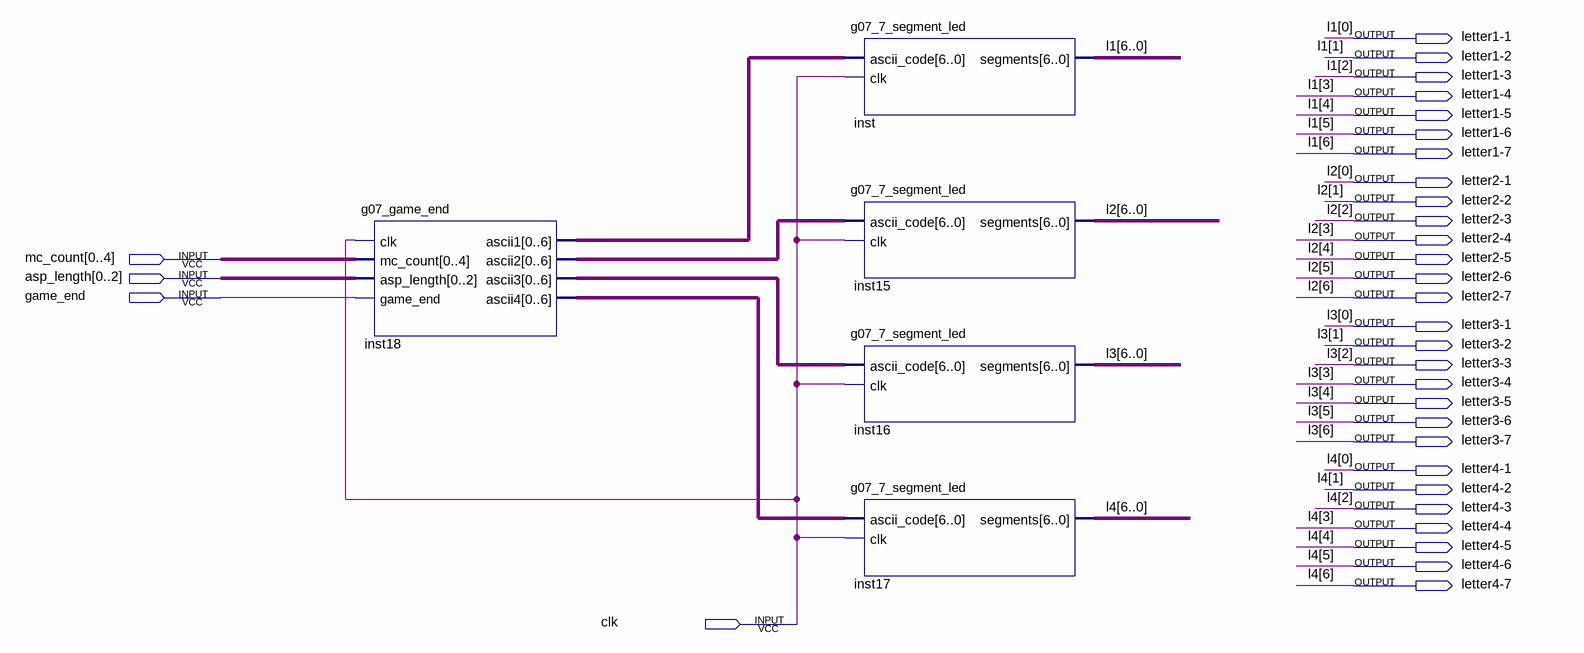
[diagram p0: schematic sheet]
// Quartus schematic g07_game_termination.bdf as structural Verilog: 5 symbols, 32 pins
module g07_game_termination (
  input  [0:4] mc_count,
  input  [0:2] asp_length,
  input  game_end,
  input  clk,
  output \letter1-1 ,
  output \letter1-2 ,
  output \letter1-3 ,
  output \letter1-4 ,
  output \letter1-5 ,
  output \letter1-6 ,
  output \letter1-7 ,
  output \letter2-1 ,
  output \letter2-2 ,
  output \letter2-3 ,
  output \letter2-4 ,
  output \letter2-5 ,
  output \letter2-6 ,
  output \letter2-7 ,
  output \letter3-1 ,
  output \letter3-2 ,
  output \letter3-3 ,
  output \letter3-4 ,
  output \letter3-5 ,
  output \letter3-6 ,
  output \letter3-7 ,
  output \letter4-1 ,
  output \letter4-2 ,
  output \letter4-3 ,
  output \letter4-4 ,
  output \letter4-5 ,
  output \letter4-6 ,
  output \letter4-7 
);

  wire [6:0] inst18_ascii1, inst18_ascii2, inst18_ascii3, inst18_ascii4;

  g07_game_end inst18 (
    .clk(clk), .mc_count(mc_count), .asp_length(asp_length), .game_end(game_end), .ascii1(inst18_ascii1),
    .ascii2(inst18_ascii2), .ascii3(inst18_ascii3), .ascii4(inst18_ascii4));
  g07_7_segment_led inst (
    .ascii_code(inst18_ascii1), .clk(clk),
    .segments({\letter1-7 , \letter1-6 , \letter1-5 , \letter1-4 , \letter1-3 , \letter1-2 , \letter1-1 }));
  g07_7_segment_led inst15 (
    .ascii_code(inst18_ascii2), .clk(clk),
    .segments({\letter2-7 , \letter2-6 , \letter2-5 , \letter2-4 , \letter2-3 , \letter2-2 , \letter2-1 }));
  g07_7_segment_led inst16 (
    .ascii_code(inst18_ascii3), .clk(clk),
    .segments({\letter3-7 , \letter3-6 , \letter3-5 , \letter3-4 , \letter3-3 , \letter3-2 , \letter3-1 }));
  g07_7_segment_led inst17 (
    .ascii_code(inst18_ascii4), .clk(clk),
    .segments({\letter4-7 , \letter4-6 , \letter4-5 , \letter4-4 , \letter4-3 , \letter4-2 , \letter4-1 }));

  // Other names for the same wires on the sheet: l1[6:0] = {\letter1-7 , \letter1-6 , \letter1-5 , \letter1-4 , \letter1-3 , \letter1-2 , \letter1-1 };
  //   l2[6:0] = {\letter2-7 , \letter2-6 , \letter2-5 , \letter2-4 , \letter2-3 , \letter2-2 , \letter2-1 };
  //   l3[6:0] = {\letter3-7 , \letter3-6 , \letter3-5 , \letter3-4 , \letter3-3 , \letter3-2 , \letter3-1 };
  //   l4[6:0] = {\letter4-7 , \letter4-6 , \letter4-5 , \letter4-4 , \letter4-3 , \letter4-2 , \letter4-1 }
endmodule
